# Altium project SpaceSalmon.PrjPcb (part 2 of 2)

## Sheet SAMD51.SchDoc
size A4
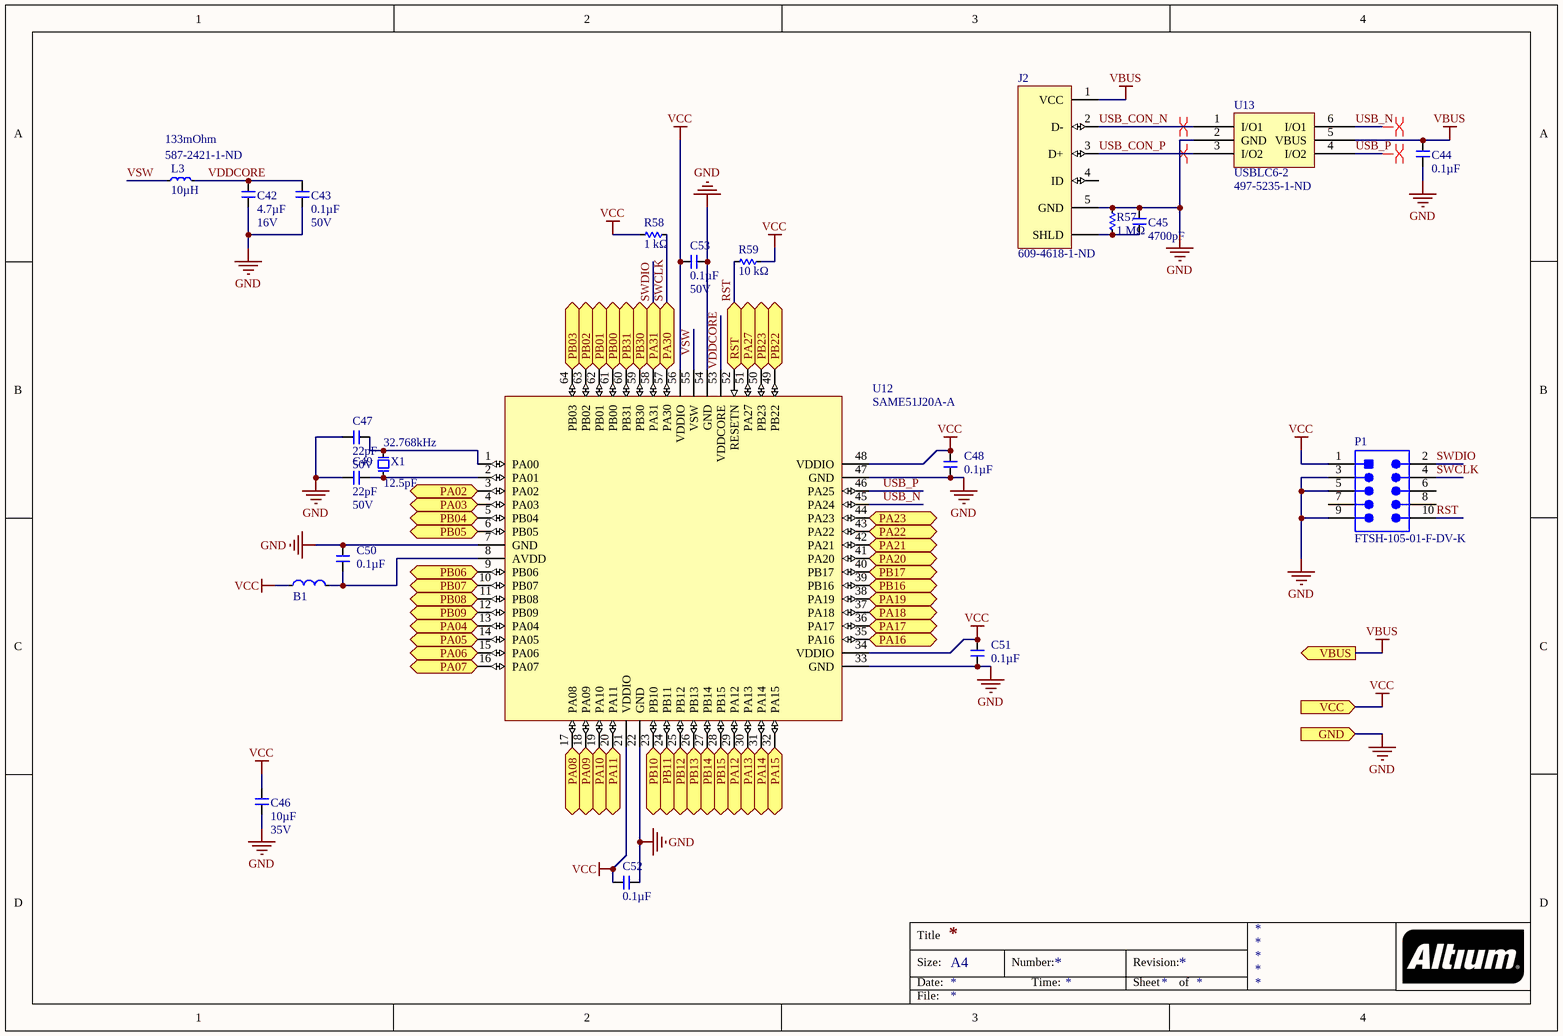
[diagram p5: SAMD51.SchDoc]

### Parts
B1  FB_1608  [R0603]  (value not drawn)
C42  Capacitance (shorthand): 4.7µF  Rated Voltage: 16V  [C0603]  (hidden comment: __template_cap)
C43  Capacitance (shorthand): 0.1µF  Rated Voltage: 50V  [C0603]  (hidden comment: __template_cap)
C44  Capacitance (shorthand): 0.1µF  [C0603]  (hidden comment: __template_cap)
C45  Capacitance (shorthand): 4700pF  [C0603]  (hidden comment: __template_cap)
C46  Capacitance (shorthand): 10µF  Rated Voltage: 35V  [C0603]  (hidden comment: __template_cap)
C47  Capacitance (shorthand): 22pF  Rated Voltage: 50V  [C0603]  (hidden comment: __template_cap)
C48  Capacitance (shorthand): 0.1µF  [C0603]  (hidden comment: __template_cap)
C49  Capacitance (shorthand): 22pF  Rated Voltage: 50V  [C0603]  (hidden comment: __template_cap)
C50  Capacitance (shorthand): 0.1µF  [C0603]  (hidden comment: __template_cap)
C51  Capacitance (shorthand): 0.1µF  [C0603]  (hidden comment: __template_cap)
C52  Capacitance (shorthand): 0.1µF  [C0603]  (hidden comment: __template_cap)
C53  Capacitance (shorthand): 0.1µF  Rated Voltage: 50V  [C0603]  (hidden comment: __template_cap)
J2  Supplier Part Number 1: 609-4618-1-ND  [CONN_USBMICROB_10118194-0001LF]  (hidden comment: CONN_USB_MICROB_SMD_TH_R/A)
L3  DC Resistance (DCR): 133mOhm  Inductance: 10µH  Supplier Part Number 1: 587-2421-1-ND  [C1210]  (hidden comment: INDUCTOR 100UH 270MA 1210 SMD)
P1  FTSH-105-01-F-DV-K  [SMTC-FTSH-105-01-L-DV-K_V]
R57  Resistance: 1 MΩ  [R0603]  (hidden comment: __template_resistor)
R58  Resistance: 1 kΩ  [R0603]  (hidden comment: __template_resistor)
R59  Resistance: 10 kΩ  [R0603]  (hidden comment: __template_resistor)
U12  SAME51J20A-A  [SAMD TQFP-64]
U13  USBLC6-2  Supplier Part Number 1: 497-5235-1-ND  [6SOT23]
X1  Frequency: 32.768kHz  Load Capacitance: 12.5pF  [XTAL_TXC_9HT10]  (hidden comment: XTAL_9HT10-32.768KEZF-T)

### Ports
GND (in), PA02 (bidir), PA03 (bidir), PA04 (bidir), PA05 (bidir), PA06 (bidir), PA07 (bidir), PA08 (bidir), PA09 (bidir), PA10 (bidir), PA11 (bidir), PA12 (bidir), PA13 (bidir), PA14 (bidir), PA15 (bidir), PA16 (bidir), PA17 (bidir), PA18 (bidir), PA19 (bidir), PA20 (bidir), PA21 (bidir), PA22 (bidir), PA23 (bidir), PA27 (bidir), PA30 (bidir), PA31 (bidir), PB00 (bidir), PB01 (bidir), PB02 (bidir), PB03 (bidir), PB04 (bidir), PB05 (bidir), PB06 (bidir), PB07 (bidir), PB08 (bidir), PB09 (bidir), PB10 (bidir), PB11 (bidir), PB12 (bidir), PB13 (bidir), PB14 (bidir), PB15 (bidir), PB16 (bidir), PB17 (bidir), PB22 (bidir), PB23 (bidir), PB30 (bidir), PB31 (bidir), RST (bidir), VBUS (out), VCC (in)

### Nets
GND: C42.1 C43.2 C44.2 C45.1 C46.1 C47.1 C48.1 C49.1 C50.1 C51.1 C52.2 C53.1 J2.5(GND) P1.3 P1.5 P1.9 R57.2 U12.7(GND) U12.22(GND) U12.33(GND) U12.47(GND) U12.54(GND) U13.2(GND) ; port GND  [project net SELF_GND]
VBACKUP: U12.64(PB03) ; port PB03
VBUS: C44.1 J2.1(VCC) U13.5(VBUS) ; port VBUS
VCC: B1.1 C46.2 C48.2 C51.2 C52.1 C53.2 P1.1 R58.2 R59.2 U12.21(VDDIO) U12.34(VDDIO) U12.48(VDDIO) U12.56(VDDIO) ; port VCC  [project net 3V3]
ACCEL_CS_1: U12.12(PB09) ; port PB09
ACCEL_CS_2: U12.6(PB05) ; port PB05
ACCEL_INT_1: U12.50(PB23) ; port PB23
ACCEL_INT_2: U12.39(PB16) ; port PB16
ADXL_CS_1: U12.9(PB06) ; port PB06
ADXL_CS_2: U12.3(PA02) ; port PA02
ADXL_INT_1: U12.49(PB22) ; port PB22
ADXL_INT_2: U12.31(PA14) ; port PA14
BAT_SNS_A: U12.63(PB02) ; port PB02
BAT_SNS_B: U12.62(PB01) ; port PB01
BMP_CS_1: U12.10(PB07) ; port PB07
BMP_CS_2: U12.4(PA03) ; port PA03
BUZZER: U12.61(PB00) ; port PB00
CAN_STBY_1: U12.41(PA20) ; port PA20
CAN_STBY_2: U12.42(PA21) ; port PA21
GYRO_CS_1: U12.11(PB08) ; port PB08
GYRO_CS_2: U12.5(PB04) ; port PB04
GYRO_INT_1: U12.51(PA27) ; port PA27
GYRO_INT_2: U12.40(PB17) ; port PB17
LED_3: U12.59(PB30) ; port PB30
LED_4: U12.60(PB31) ; port PB31
MISO: U12.13(PA04) ; port PA04
MOSI: U12.16(PA07) ; port PA07
RST: P1.10 R59.1 U12.52(RESETN) ; port RST
SCK: U12.14(PA05) ; port PA05
SD_CD: U12.15(PA06) ; port PA06
SD_CLK: U12.24(PB11) ; port PB11
SD_CMD: U12.17(PA08) ; port PA08
SD_DAT0: U12.18(PA09) ; port PA09
SD_DAT1: U12.19(PA10) ; port PA10
SD_DAT2: U12.20(PA11) ; port PA11
SD_DAT3: U12.23(PB10) ; port PB10
SWCLK: P1.4 R58.1 U12.57(PA30) ; port PA30  [project net LED_1]
SWDIO: P1.2 U12.58(PA31) ; port PA31  [project net LED_2]
USB_CON_N: J2.2(D-) U13.1(I/O1)
USB_CON_P: J2.3(D+) U13.3(I/O2)
USB_N: U12.45(PA24) U13.6(I/O1)
USB_P: U12.46(PA25) U13.4(I/O2)
VDDCORE: C42.2 C43.1 L3.1 U12.53(VDDCORE)
VSW: L3.2 U12.55(VSW)
NetB1_2: B1.2 C50.2 U12.8(AVDD)
NetC45_2: C45.2 J2.SHIELD(SHLD) R57.1
NetC47_2: C47.2 U12.1(PA00) X1.2
NetC49_2: C49.2 U12.2(PA01) X1.1
NetCANA1_1: U12.26(PB13) ; port PB13
NetCANA1_4: U12.25(PB12) ; port PB12
NetCANB1_1: U12.44(PA23) ; port PA23
NetCANB1_4: U12.43(PA22) ; port PA22
NetJ1_1: U12.30(PA13) ; port PA13
NetJ1_2: U12.29(PA12) ; port PA12
NetU12_27: U12.27(PB14) ; port PB14
NetU12_28: U12.28(PB15) ; port PB15
NetU12_32: U12.32(PA15) ; port PA15
NetU12_35: U12.35(PA16) ; port PA16
NetU12_36: U12.36(PA17) ; port PA17
NetU12_37: U12.37(PA18) ; port PA18
NetU12_38: U12.38(PA19) ; port PA19

Not connected (* = marked no-connect by the designer): J2 4(ID); P1 6 7 8

### Layout directives
differential pair: USB_CON_N, USB_CON_P, USB_N, USB_P

### Notes on the sheet
- Title
- Size:
- Date:
- A4
- Number:
- Time:
- Revision:
- Sheet
- of
- File:

### Library data of the parts
B1 = FB_1608: FERRITE BEAD 600 OHM 300mA; Manufacturer: Taiyo Yuden; Manufacturer Part Number: BK1608HW601-T; Number of Lines: 1; Impedance @ Frequency: 600 Ohm @ 100MHz; DC Resistance (DCR) (Max): 400 mOhm; Supplier 1: Digi-Key; Supplier Part Number 1: 587-1879-1-ND; RoHS: RoHS Compliant; Category: Filters; Stock 1: 11908; Pricing 1: 1=0.1, 10=0.059, 50=0.0474, 100=0.0426, 250=0.0312, 500=0.0227, 1000=0.02223 (USD); Packaging: Cut Tape (CT); Part Status: Active; Filter Type: -; Current Rating (Max): 300mA; Ratings: -; Operating Temperature: -55°C ~ 125°C; Package / Case: 0603 (1608 Metric); Mounting Type: Surface Mount; Height (Max): 0.037" (0.95mm); Size / Dimension: 0.063" L x 0.031" W (1.60mm x 0.80mm); ComponentLink1URL: http://ds.yuden.co.jp/TYCOMPAS/ut/detail.do?productNo=BK1608HW601-T&fileName=BK1608HW601-T_SS&mode=specSheetDownload; ComponentLink1Description: http://ds.yuden.co.jp/TYCOMPAS/ut/detail.do?productNo=BK1608HW601-T&fileName=BK1608HW601-T_SS&mode=specSheetDownload
C42 = CAP CER 4.7UF 16V X5R 0603 10%: Manufacturer: Yageo; Capacitance - pF (Machine readable): 4700000; type: capacitor; Dielectric: X5R; Supplier 1: Digikey; Supplier Part Number 1: 311-1785-1-ND
C43 C44 C48 C50-C53 = CAP CER 0603 0.1µF X7R 50V 10%: Manufacturer: Murata Electronics North America; Capacitance - pF (Machine readable): 100000; type: capacitor; Dielectric: X7R; Supplier 1: Digikey; Supplier Part Number 1: 490-1519-1-ND
C45 = CAP CER 0603 4700pF X7R 50V 10%: Manufacturer: Murata Electronics North America; Capacitance - pF (Machine readable): 4700; type: capacitor; Dielectric: X7R; Supplier 1: Digikey; Supplier Part Number 1: 490-1506-1-ND
C46 = CAP CER 10UF 35V X5R 0603 20%: Manufacturer: Murata Electronics North America; Capacitance - pF (Machine readable): 10000000; type: capacitor; Dielectric: X5R; Supplier 1: Digikey; Supplier Part Number 1: 490-13248-1-ND
C47 C49 = CAP CER 22PF 50V C0G/NP0 0603: Manufacturer: Murata Electronics North America; Capacitance - pF (Machine readable): 22; type: capacitor; Dielectric: C0G, NP0; Description: CAP CER 22PF 50V C0G/NP0 0603; Supplier 1: Digikey; Supplier Part Number 1: 490-1411-1-ND
J2 = CONN_USB_MICROB_SMD_TH_R/A: Through Hole Micro USB Connector; Manufacturer: Amphenol FCI; Manufacturer Part Number: 10118194-0001LF; Gender: Receptacle; Current Rating: 1.8A; Connector Type: USB,Receptacle; Number of Contacts: 5; Insulation Resistance: 1GR; Number of Ports: 1; Max Voltage Rating (AC): 100V; Pitch: 0.65mm; Supplier 1: Digi-Key; Stock 1: 180464; Pricing 1: 1=0.46, 10=0.437, 25=0.3744, 50=0.318, 100=0.3056, 250=0.2744, 500=0.262 (USD); Mount: Surface Mount,Horizontal; Contact Material: Copper Alloy; Contact Plating: Nickel,Gold; Number of Terminals: 5; Housing Material: Polymer; Colour: Black; Min Operating Temperature: -55°C; Max Operating Temperature: 85°C; Package Quantity: 9600; Packaging: Tape and Reel; Termination: Solder; Orientation: Right Angle; Length: 8.05mm; Depth: 5mm; Radiation Hardening: No; Lead Free: Lead Free; Flammability Rating: UL94 V-0; ComponentLink1URL: https://datasheet.ciiva.com/851/10118194-851110.pdf; ComponentLink1Description: https://datasheet.ciiva.com/851/10118194-851110.pdf; ComponentLink2URL: https://datasheet.ciiva.com/851/10118194-851111.pdf; ComponentLink2Description: https://datasheet.ciiva.com/851/10118194-851111.pdf; ComponentLink3URL: https://datasheet.ciiva.com/4598/10118194ac-197217-4598807.pdf; ComponentLink3Description: https://datasheet.ciiva.com/4598/10118194ac-197217-4598807.pdf; ComponentLink4URL: https://datasheet.ciiva.com/29907/10118194-29907230.pdf; ComponentLink4Description: https://datasheet.ciiva.com/29907/10118194-29907230.pdf; ComponentLink5URL: https://datasheet.ciiva.com/26945/getdatasheetpartid-418619-26945695.pdf; ComponentLink5Description: https://datasheet.ciiva.com/26945/getdatasheetpartid-418619-26945695.pdf
L3 = IND_BRL3225T101K: Manufacturer: Taiyo Yuden; Current - Temperature Rise: 250mA; Tolerance: ±10%; Shielding: Unshielded; Frequency - Self Resonant: 5MHz; Frequency - Test: 100kHz; Manufacturer Part Number: BRL3225T101K; RoHS: RoHS Compliant; Category: Inductors, Coils, Chokes; Current - Saturation: 270mA; Type: -; Q @ Freq: -; Applications: Power Supplies; Material - Core: -; Package / Case: 1210 (3225 Metric); Mounting Type: Surface Mount; Packaging: Cut Tape (CT); Operating Temperature: -40°C ~ 105°C; ComponentLink1URL: http://www.yuden.co.jp/ut/product/pdf/wound07_e.pdf; ComponentLink1Description: Datasheet; Current: 270mA; Supplier 1: Digi-Key
P1 = CMP-2000-05352-1: Male Header, Pitch 1.27 mm, 2 x 5 Position, Height 6.12 mm, RoHS, Tube; Manufacturer: Samtec; Number of Positions: 10; Connector Type: Header,Shrouded; Number of Positions Loaded: All; Fastening Type: -; Package Reference: FTSH-105-01-L-DV-K; Termination: Solder; Package URL: http://suddendocs.samtec.com/prints/ftsh-1xx-xx-xxx-dv-xxx-footprint.pdf; Number of Rows: 2; Contact Finish Thickness: 3µin(0.08µm); Contact Type: MalePin; Manufacturer URL: http://www.samtec.com/; Series: FTSH; Features: -; Contact Finish: Gold; Color: Black; Family: RectangularConnectors-Headers,MalePins; Datasheet URL: http://suddendocs.samtec.com/prints/ftsh-1xx-xx-xxx-dv-xxx-mkt.pdf; Package Description: Male Header, Pitch 1.27 mm, 2 x 5 Position, Height 5.97 mm, Tail Length 4.32 mm; Mounting Type: SurfaceMount; Datasheet Version: Rev. ET, 10/1995; Category: Connectors,Interconnects; Packaging: Tube
R57 = RES SMD 1M OHM 1% 1/10W 0603: Manufacturer Part Number: RC0603FR-071ML; Manufacturer: Yageo; Resistance (Sortable): 1000000; Tolerance: ±1%; Power (Watts): 0.1W, 1/10W; Temperature Coefficient: ±100ppm/°C; Supplier 1: Digikey; Datasheets: http://www.yageo.com/documents/recent/PYu-RC_Group_51_RoHS_L_9.pdf; Image: //media.digikey.com/Renders/Yageo%20Renders/0603-(1608-Metric).jpg; Supplier Part Number 1: 311-1.00MHRCT-ND; Operating Temperature: -55°C ~ 155°C
R58 = RES SMD 1K OHM 1% 1/10W 0603: Manufacturer Part Number: RC0603FR-071KL; Manufacturer: Yageo; Resistance (Sortable): 1000; Tolerance: ±1%; Power (Watts): 0.1W, 1/10W; Temperature Coefficient: ±100ppm/°C; Supplier 1: Digikey; Datasheets: http://www.yageo.com/documents/recent/PYu-RC_Group_51_RoHS_L_9.pdf; Image: //media.digikey.com/Renders/Yageo%20Renders/0603-(1608-Metric).jpg; Supplier Part Number 1: 311-1.00KHRCT-ND; Operating Temperature: -55°C ~ 155°C
R59 = RES SMD 10K OHM 1% 1/10W 0603: Manufacturer Part Number: RC0603FR-0710KL; Manufacturer: Yageo; Resistance (Sortable): 10000; Tolerance: ±1%; Power (Watts): 0.1W, 1/10W; Temperature Coefficient: ±100ppm/°C; Supplier 1: Digikey; Datasheets: http://www.yageo.com/documents/recent/PYu-RC_Group_51_RoHS_L_9.pdf; Image: //media.digikey.com/Renders/Yageo%20Renders/0603-(1608-Metric).jpg; Supplier Part Number 1: 311-10.0KHRCT-ND; Operating Temperature: -55°C ~ 155°C
U12 = SAME51J20A-A: Atmel SAM ARM Cortex M4; ComponentLink1Description: Product Page; ComponentLink1URL: https://www.microchip.com/wwwproducts/en/ATSAMD21G18; ComponentLink2Description: Datasheet; ComponentLink2URL: http://ww1.microchip.com/downloads/en/DeviceDoc/SAM-D21-Family-Datasheet-DS40001882C.pdf
U13 = USBLC6-2: Manufacturer: STMicroelectronics; Manufacturer Part Number: USBLC6-2SC6; Unidirectional Channels: 2; Voltage - Reverse Standoff (Typ): 5.25V; Voltage - Breakdown (Min): 6V; Voltage - Clamping (Max) @ Ipp: 17V; Current - Peak Pulse (10/1000µs): 5A (8/20µs); Power Line Protection: Yes; Supplier 1: Digi-Key; RoHS: RoHS Compliant; Category: Circuit Protection; Stock 1: 31719; Pricing 1: 1=0.51, 10=0.411, 100=0.2802, 500=0.21012, 1000=0.15759 (USD); Packaging: Cut Tape (CT); Part Status: Active; Type: Steering (Rail to Rail); Bidirectional Channels: -; Power - Peak Pulse: -; Applications: Ethernet; Capacitance @ Frequency: -; Operating Temperature: -40°C ~ 125°C (TJ); Mounting Type: Surface Mount; Package / Case: SOT-23-6; Supplier Device Package: SOT-23-6; ComponentLink1URL: http://www.st.com/web/en/resource/technical/document/datasheet/CD00050750.pdf; ComponentLink1Description: http://www.st.com/web/en/resource/technical/document/datasheet/CD00050750.pdf
X1 = XTAL_9HT10-32.768KEZF-T: CRYSTAL 32.768 KHZ 12.5 PF SMD; Manufacturer: TXC CORPORATION; Frequency Tolerance: ±10ppm; ESR (Equivalent Series Resistance): 70 kOhm; Operating Mode: Fundamental; Supplier 1: Digi-Key; Manufacturer Part Number: 9HT10-32.768KEZF-T; RoHS: RoHS Compliant; Category: Crystals and Oscillators; Stock 1: 5250; Pricing 1: 1=1.88, 10=1.625, 50=1.425, 100=1.125, 500=0.95, 1000=0.75 (USD); Type: kHz Crystal (Tuning Fork); Frequency Stability: -; Operating Temperature: -40°C ~ 85°C; Ratings: -; Mounting Type: Surface Mount; Package / Case: 2-SMD; Size / Dimension: 0.126" L x 0.059" W (3.20mm x 1.50mm); Height: 0.033" (0.85mm); Packaging: Cut Tape (CT); ComponentLink1URL: http://www.txccrystal.com/images/pdf/9ht10.pdf; ComponentLink1Description: Datasheet; Supplier Part Number 1: 887-1507-1-ND

## Sheet Stack_B.SchDoc
size A4
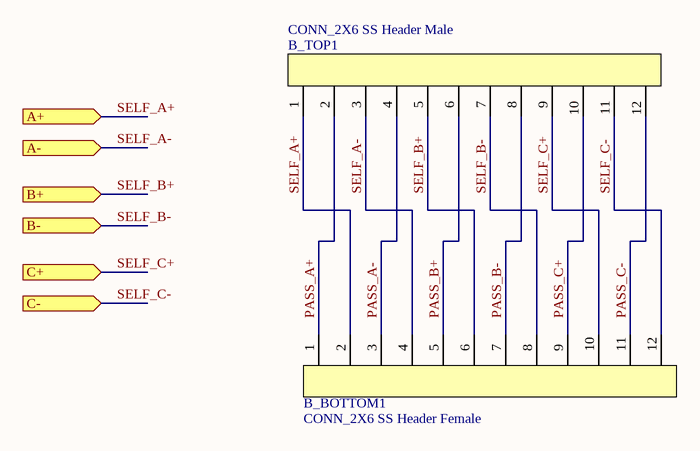
[diagram p6: Stack_B.SchDoc]

### Parts
B_BOTTOM1  CONN_2X6 SS Header Female  [SAMTEC_SSW-106-22-F-D-VS]
B_TOP1  CONN_2X6 SS Header Male  [SAMTEC_TSM-106-03-F-DV]

### Ports
A+ (in), A- (in), B+ (in), B- (in), C+ (in), C- (in)

### Nets
PASS_A+: B_BOTTOM1.1 B_TOP1.2
PASS_A-: B_BOTTOM1.3 B_TOP1.4
PASS_B+: B_BOTTOM1.5 B_TOP1.6
PASS_B-: B_BOTTOM1.7 B_TOP1.8
PASS_C+: B_BOTTOM1.9 B_TOP1.10
PASS_C-: B_BOTTOM1.11 B_TOP1.12
SELF_A+: B_BOTTOM1.2 B_TOP1.1 ; port A+
SELF_A-: B_BOTTOM1.4 B_TOP1.3 ; port A-
SELF_B+: B_BOTTOM1.6 B_TOP1.5 ; port B+
SELF_B-: B_BOTTOM1.8 B_TOP1.7 ; port B-
SELF_C+: B_BOTTOM1.10 B_TOP1.9 ; port C+
SELF_C-: B_BOTTOM1.12 B_TOP1.11 ; port C-

### Notes on the sheet
- Title
- Size:
- Date:
- A4
- Number:
- Time:
- Revision:
- Sheet
- of
- File:

### Library data of the parts
B_BOTTOM1 B_TOP1 = CONN_2X6 SS Header

## Sheet Stack_A.SchDoc
size A3 portrait
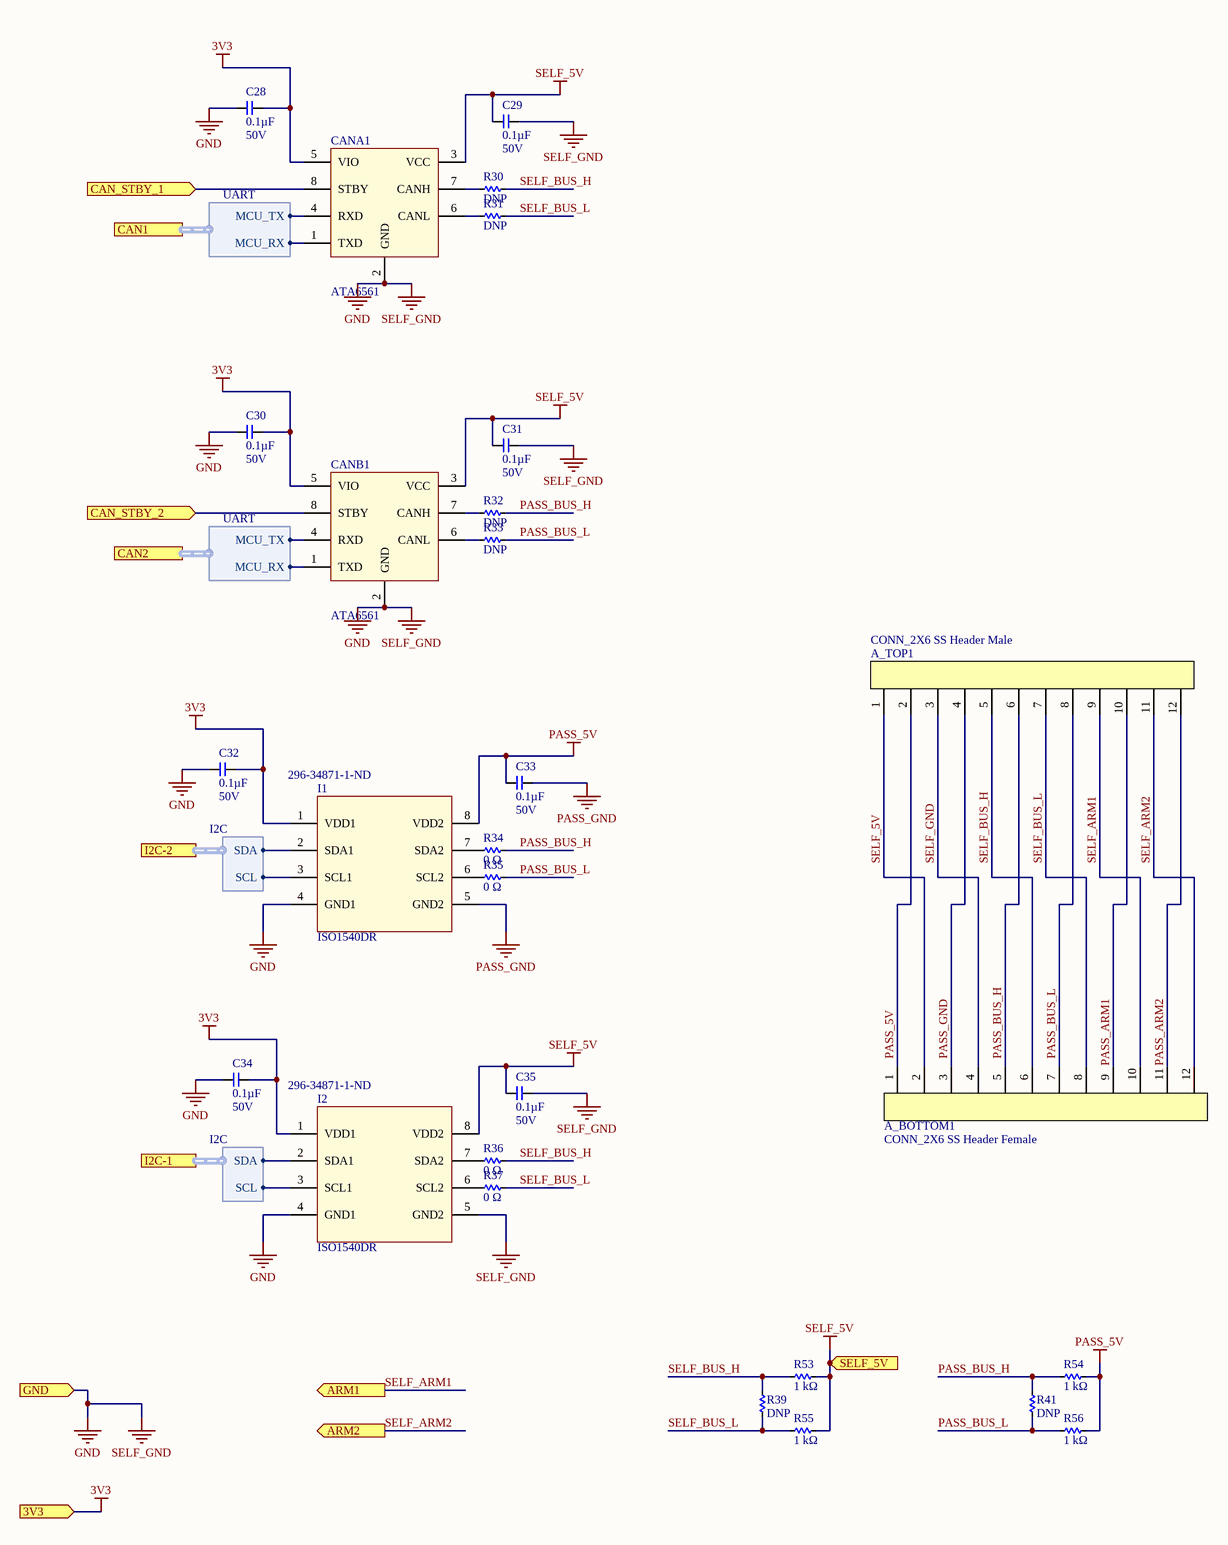
[diagram p7: Stack_A.SchDoc]

### Parts
A_BOTTOM1  CONN_2X6 SS Header Female  [SAMTEC_SSW-106-22-F-D-VS]
A_TOP1  CONN_2X6 SS Header Male  [SAMTEC_TSM-106-03-F-DV]
C28  Capacitance (shorthand): 0.1µF  Rated Voltage: 50V  [C0603]  (hidden comment: __template_cap)
C29  Capacitance (shorthand): 0.1µF  Rated Voltage: 50V  [C0603]  (hidden comment: __template_cap)
C30  Capacitance (shorthand): 0.1µF  Rated Voltage: 50V  [C0603]  (hidden comment: __template_cap)
C31  Capacitance (shorthand): 0.1µF  Rated Voltage: 50V  [C0603]  (hidden comment: __template_cap)
C32  Capacitance (shorthand): 0.1µF  Rated Voltage: 50V  [C0603]  (hidden comment: __template_cap)
C33  Capacitance (shorthand): 0.1µF  Rated Voltage: 50V  [C0603]  (hidden comment: __template_cap)
C34  Capacitance (shorthand): 0.1µF  Rated Voltage: 50V  [C0603]  (hidden comment: __template_cap)
C35  Capacitance (shorthand): 0.1µF  Rated Voltage: 50V  [C0603]  (hidden comment: __template_cap)
CANA1  ATA6561  [8SOIC150]
CANB1  ATA6561  [8SOIC150]
I1  Manufacturer Part Number: ISO1540DR  Supplier Part Number 1: 296-34871-1-ND  [8SOIC150]  (hidden comment: ISO_Si8401AB-B-IS)
I2  Manufacturer Part Number: ISO1540DR  Supplier Part Number 1: 296-34871-1-ND  [8SOIC150]  (hidden comment: ISO_Si8401AB-B-IS)
R30  Resistance: DNP  [R0603]  (hidden comment: __template_resistor)
R31  Resistance: DNP  [R0603]  (hidden comment: __template_resistor)
R32  Resistance: DNP  [R0603]  (hidden comment: __template_resistor)
R33  Resistance: DNP  [R0603]  (hidden comment: __template_resistor)
R34  Resistance: 0 Ω  [R0603]  (hidden comment: __template_resistor)
R35  Resistance: 0 Ω  [R0603]  (hidden comment: __template_resistor)
R36  Resistance: 0 Ω  [R0603]  (hidden comment: __template_resistor)
R37  Resistance: 0 Ω  [R0603]  (hidden comment: __template_resistor)
R39  Resistance: DNP  [R0603]  (hidden comment: __template_resistor)
R41  Resistance: DNP  [R0603]  (hidden comment: __template_resistor)
R53  Resistance: 1 kΩ  [R0603]  (hidden comment: __template_resistor)
R54  Resistance: 1 kΩ  [R0603]  (hidden comment: __template_resistor)
R55  Resistance: 1 kΩ  [R0603]  (hidden comment: __template_resistor)
R56  Resistance: 1 kΩ  [R0603]  (hidden comment: __template_resistor)

### Ports
3V3 (in), ARM1 (out), ARM2 (out), CAN1 (harness UART), CAN2 (harness UART), CAN_STBY_1 (in), CAN_STBY_2 (in), GND (in), I2C-1 (harness I2C), I2C-2 (harness I2C), SELF_5V (in)

### Harnesses
UART: MCU_RX, MCU_TX
I2C: SDA, SCL

### Nets
3V3: C28.2 C30.2 C32.2 C34.2 CANA1.5(VIO) CANB1.5(VIO) I1.1(VDD1) I2.1(VDD1) ; port 3V3
PASS_5V: A_BOTTOM1.1 A_TOP1.2 C33.2 I1.8(VDD2) R54.2 R56.2
PASS_GND: A_BOTTOM1.3 A_TOP1.4 C33.1 I1.5(GND2)
SELF_5V: A_BOTTOM1.2 A_TOP1.1 C29.2 C31.2 C35.2 CANA1.3(VCC) CANB1.3(VCC) I2.8(VDD2) R53.2 R55.2 ; port SELF_5V  [project net 5V0]
SELF_GND: A_BOTTOM1.4 A_TOP1.3 C28.1 C29.1 C30.1 C31.1 C32.1 C34.1 C35.1 CANA1.2(GND) CANB1.2(GND) I1.4(GND1) I2.4(GND1) I2.5(GND2) ; port GND  [also labelled GND]
CAN_STBY_1: CANA1.8(STBY) ; port CAN_STBY_1
CAN_STBY_2: CANB1.8(STBY) ; port CAN_STBY_2
PASS_ARM1: A_BOTTOM1.9 A_TOP1.10
PASS_ARM2: A_BOTTOM1.11 A_TOP1.12
PASS_BUS_H: A_BOTTOM1.5 A_TOP1.6 R32.2 R34.2 R41.2 R54.1
PASS_BUS_L: A_BOTTOM1.7 A_TOP1.8 R33.2 R35.2 R41.1 R56.1
SELF_ARM1: A_BOTTOM1.10 A_TOP1.9 ; port ARM1
SELF_ARM2: A_BOTTOM1.12 A_TOP1.11 ; port ARM2
SELF_BUS_H: A_BOTTOM1.6 A_TOP1.5 R30.2 R36.2 R39.2 R53.1
SELF_BUS_L: A_BOTTOM1.8 A_TOP1.7 R31.2 R37.2 R39.1 R55.1
NetCANA1_1: CANA1.1(TXD) I2.3(SCL1) ; port CAN1.MCU_RX, port I2C-1.SCL
NetCANA1_4: CANA1.4(RXD) I2.2(SDA1) ; port CAN1.MCU_TX, port I2C-1.SDA
NetCANA1_6: CANA1.6(CANL) R31.1
NetCANA1_7: CANA1.7(CANH) R30.1
NetCANB1_1: CANB1.1(TXD) I1.2(SDA1) ; port I2C-2.SDA, port CAN2.MCU_RX
NetCANB1_4: CANB1.4(RXD) I1.3(SCL1) ; port I2C-2.SCL, port CAN2.MCU_TX
NetCANB1_6: CANB1.6(CANL) R33.1
NetCANB1_7: CANB1.7(CANH) R32.1
NetI1_6: I1.6(SCL2) R35.1
NetI1_7: I1.7(SDA2) R34.1
NetI2_6: I2.6(SCL2) R37.1
NetI2_7: I2.7(SDA2) R36.1

### Notes on the sheet
- Title
- Size:
- Date:
- A3
- Number:
- Time:
- Revision:
- Sheet
- of
- File:

### Library data of the parts
A_BOTTOM1 A_TOP1 = CONN_2X6 SS Header
C28-C35 = CAP CER 0603 0.1µF X7R 50V 10%: as C43 on sheet SAMD51; Supplier 1: Digikey; Supplier Part Number 1: 490-1519-1-ND
CANA1 CANB1 = ATA6561: Atmel CAN Bus Transciever; Supplier 1: Digi-Key; Supplier Part Number 1: ATA6561-GAQW-NCT-ND
I1 I2 = ISO_Si8401AB-B-IS: Isolator Interface IC 2.5 kV Bidirectional I2C Isolator 1.7MHz; Manufacturer: Texas Instruments; Supply Current: 3.9 mA; Number of Channels: 2; Power Dissipation: 220 W; Supply Voltage (Max): 5.5 V; Supply Voltage (Min): 3 V; Propagation Delay Time: 20 ns; Product Status: New Technology; RoHS: RoHS Compliant; Category: Isolator Interface IC; Package / Case: SOIC-8 Narrow; Packaging: Tube; Mounting Style: SMD/SMT; Maximum Operating Temperature: + 125 C; Minimum Operating Temperature: - 40 C; Product Category: Power - Digital Isoloators; RoHS - Mouser: Y; Minimum Order Quantity: 1; Reeling: False; ComponentLink1URL: http://www.silabs.com/Support%20Documents/TechnicalDocs/Si840x.pdf; ComponentLink1Description: Datasheet; Supplier 1: Digi-Key
R30-R33 R39 R41 = RES SMD DNP 0603: Resistance (Sortable): DNP
R34-R37 = RES SMD 0 OHM JUMPER 1/10W 0603: Manufacturer Part Number: RC0603FR-070RL; Manufacturer: Yageo; Resistance (Sortable): 0; Tolerance: Jumper; Power (Watts): 0.1W, 1/10W; Supplier 1: Digikey; Datasheets: http://www.yageo.com/documents/recent/PYu-RC_Group_51_RoHS_L_9.pdf; Image: //media.digikey.com/Renders/Yageo%20Renders/0603-(1608-Metric).jpg; Supplier Part Number 1: 311-0.0HRCT-ND; Temperature Coefficient: -; Operating Temperature: -55°C ~ 155°C
R53-R56 = RES SMD 1K OHM 1% 1/10W 0603: as R58 on sheet SAMD51; Supplier 1: Digikey; Datasheets: http://www.yageo.com/documents/recent/PYu-RC_Group_51_RoHS_L_9.pdf; Image: //media.digikey.com/Renders/Yageo%20Renders/0603-(1608-Metric).jpg; Supplier Part Number 1: 311-1.00KHRCT-ND; Operating Temperature: -55°C ~ 155°C

## Sheet MC33797.SchDoc: Top Sheet
size A4; Project: World Domination Satellite
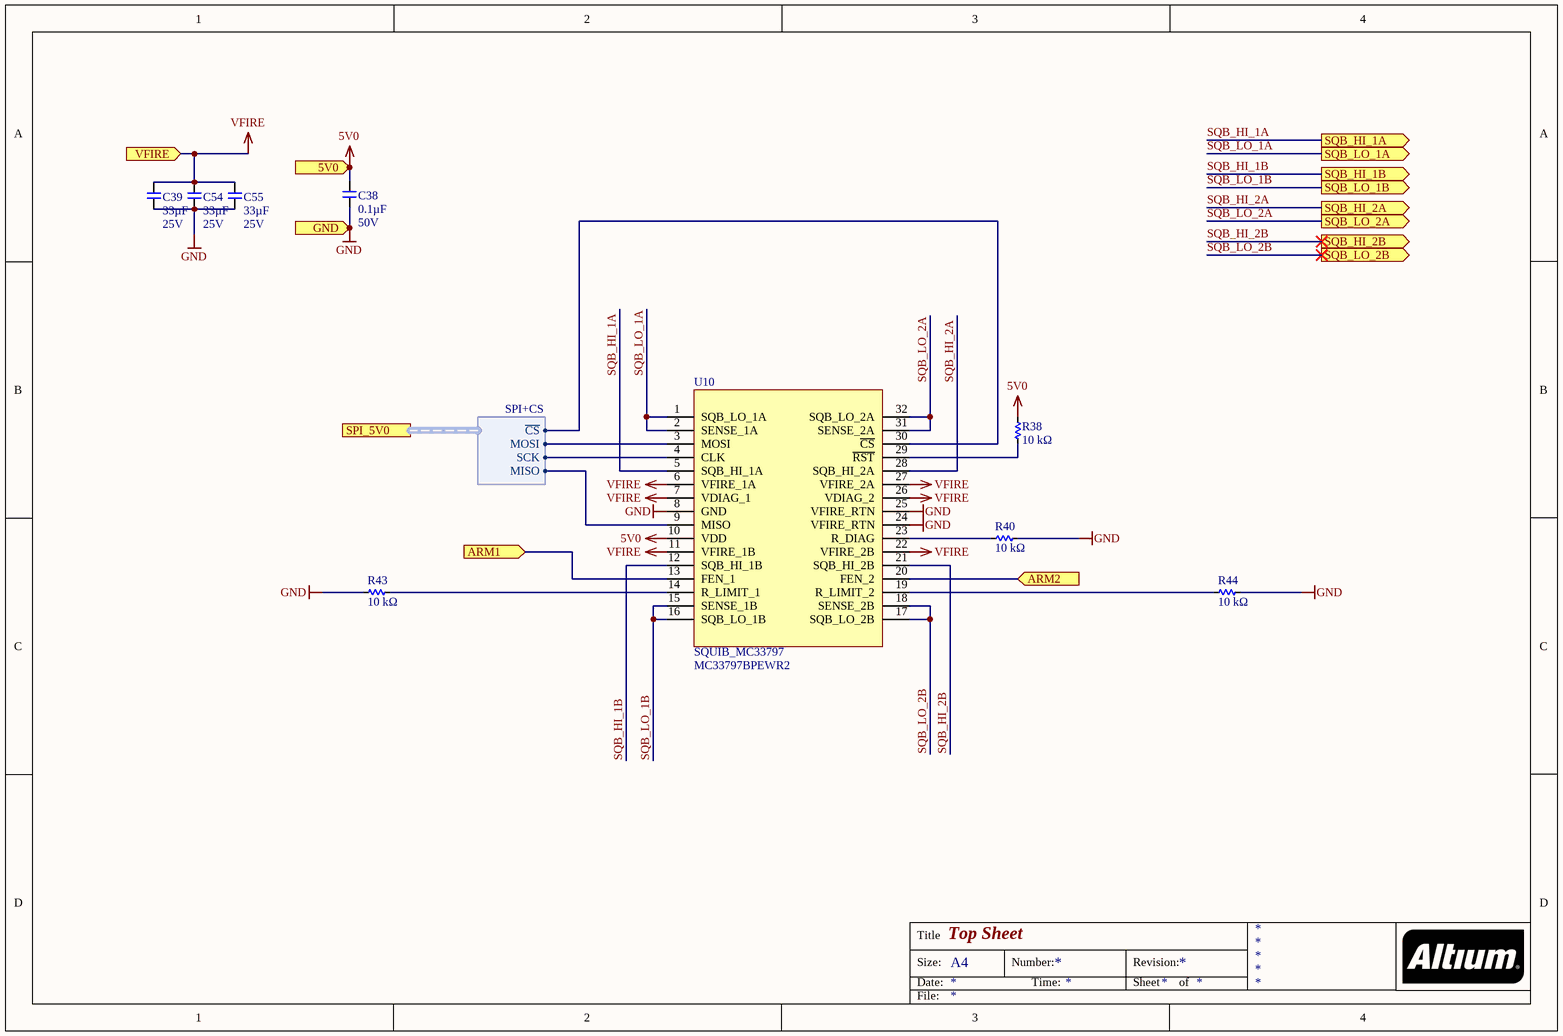
[diagram p8: MC33797.SchDoc]

### Parts
C38  Capacitance (shorthand): 0.1µF  Rated Voltage: 50V  [C0603]  (hidden comment: __template_cap)
C39  Capacitance: 33µF  Voltage - Rated: 25V  [C1206]  (hidden comment: CAP_33UF_1206_SMD)
C54  Capacitance: 33µF  Voltage - Rated: 25V  [C1206]  (hidden comment: CAP_33UF_1206_SMD)
C55  Capacitance: 33µF  Voltage - Rated: 25V  [C1206]  (hidden comment: CAP_33UF_1206_SMD)
R38  Resistance: 10 kΩ  [R0603]  (hidden comment: __template_resistor)
R40  Resistance: 10 kΩ  [R0603]  (hidden comment: __template_resistor)
R43  Resistance: 10 kΩ  [R0603]  (hidden comment: __template_resistor)
R44  Resistance: 10 kΩ  [R0603]  (hidden comment: __template_resistor)
U10  SQUIB_MC33797  Manufacturer Part Number: MC33797BPEWR2  [SOT1762-1]

### Ports
5V0 (in), ARM1 (in), ARM2 (in), GND (in), SPI_5V0 (harness SPI+CS), SQB_HI_1A (out), SQB_HI_1B (out), SQB_HI_2A (out), SQB_HI_2B (out), SQB_LO_1A (out), SQB_LO_1B (out), SQB_LO_2A (out), SQB_LO_2B (out), VFIRE (in)

### Harnesses
SPI+CS: ~{CS}, SCK, MOSI, MISO

### Nets
5V0: C38.1 R38.2 U10.10(VDD) ; port 5V0
GND: C38.2 C39.2 C54.2 C55.2 R40.2 R43.1 R44.2 U10.8(GND) U10.24(VFIRE_RTN) U10.25(VFIRE_RTN) ; port GND  [project net SELF_GND]
VFIRE: C39.1 C54.1 C55.1 U10.6(VFIRE_1A) U10.7(VDIAG_1) U10.11(VFIRE_1B) U10.22(VFIRE_2B) U10.26(VDIAG_2) U10.27(VFIRE_2A) ; port VFIRE  [project net VBAT]
ARM1: U10.13(FEN_1) ; port ARM1
ARM2: U10.20(FEN_2) ; port ARM2
SQB_HI_1A: U10.5(SQB_HI_1A) ; port SQB_HI_1A  [project net SELF_A+]
SQB_HI_1B: U10.12(SQB_HI_1B) ; port SQB_HI_1B  [project net SELF_B+]
SQB_HI_2A: U10.28(SQB_HI_2A) ; port SQB_HI_2A  [project net SELF_C+]
SQB_HI_2B: U10.21(SQB_HI_2B) ; port SQB_HI_2B
SQB_LO_1A: U10.1(SQB_LO_1A) U10.2(SENSE_1A) ; port SQB_LO_1A  [project net SELF_A-]
SQB_LO_1B: U10.15(SENSE_1B) U10.16(SQB_LO_1B) ; port SQB_LO_1B  [project net SELF_B-]
SQB_LO_2A: U10.31(SENSE_2A) U10.32(SQB_LO_2A) ; port SQB_LO_2A  [project net SELF_C-]
SQB_LO_2B: U10.17(SQB_LO_2B) U10.18(SENSE_2B) ; port SQB_LO_2B
NetR38_1: R38.1 U10.29(~{RST})
NetR40_1: R40.1 U10.23(R_DIAG)
NetR43_2: R43.2 U10.14(R_LIMIT_1)
NetR44_1: R44.1 U10.19(R_LIMIT_2)
NetU10_3: U10.3(MOSI) ; port SPI_5V0.MOSI
NetU10_4: U10.4(CLK) ; port SPI_5V0.SCK
NetU10_9: U10.9(MISO) ; port SPI_5V0.MISO
NetU10_30: U10.30(~{CS}) ; port SPI_5V0.~{CS}

### Notes on the sheet
- Title
- Size:
- Date:
- A4
- Number:
- Time:
- Revision:
- Sheet
- of
- File:

### Library data of the parts
C38 = CAP CER 0603 0.1µF X7R 50V 10%: as C43 on sheet SAMD51; Supplier Part Number 1: 490-1519-1-ND; Supplier 1: Digikey
C39 C54 C55 = CAP_100UF_1206_SMD: 100UF SMD CAP CERAMIC; Manufacturer: Murata Electronics North America; Manufacturer Part Number: GRM31CD80J107ME39L; Tolerance: ±20%; Temperature Coefficient: X6T; RoHS: RoHS Compliant; Category: Capacitors; Packaging: Cut Tape (CT); Part Status: Active; Operating Temperature: -55°C ~ 105°C; Features: Derating Recommended; Ratings: -; Applications: General Purpose; Mounting Type: Surface Mount, MLCC; Package / Case: 1206 (3216 Metric); Size / Dimension: 0.126" L x 0.063" W (3.20mm x 1.60mm); Height - Seated (Max): -; Thickness (Max): 0.071" (1.80mm); Lead Spacing: -; Lead Style: -; Supplier 1: Digi-Key; Supplier Part Number 1: 445-8046-1-ND
R38 R40 R43 R44 = RES SMD 10K OHM 1% 1/10W 0603: as R59 on sheet SAMD51; Supplier 1: Digikey; Datasheets: http://www.yageo.com/documents/recent/PYu-RC_Group_51_RoHS_L_9.pdf; Image: //media.digikey.com/Renders/Yageo%20Renders/0603-(1608-Metric).jpg; Supplier Part Number 1: 311-10.0KHRCT-ND; Operating Temperature: -55°C ~ 155°C
U10 = SQUIB_MC33797: Manufacturer: NXP USA Inc.; Interface: SPI; Voltage - Supply: 4.75 V ~ 5.25 V; Supplier 1: Digi-Key; RoHS: RoHS Compliant; Category: Integrated Circuits (ICs); Stock 1: 657; Pricing 1: 1=4.94, 10=4.437, 100=3.6354, 500=3.2136 (USD); Packaging: Cut Tape (CT); Part Status: Active; Applications: -; Package / Case: 32-SOIC (0.295", 7.50mm Width); Supplier Device Package: 32-SOIC; Mounting Type: Surface Mount; ComponentLink1URL: http://cache.freescale.com/files/analog/doc/data_sheet/MC33797.pdf; ComponentLink1Description: http://cache.freescale.com/files/analog/doc/data_sheet/MC33797.pdf; Supplier Part Number 1: MC33797BPEWR2CT-ND

## Sheet SD.SchDoc
size A4
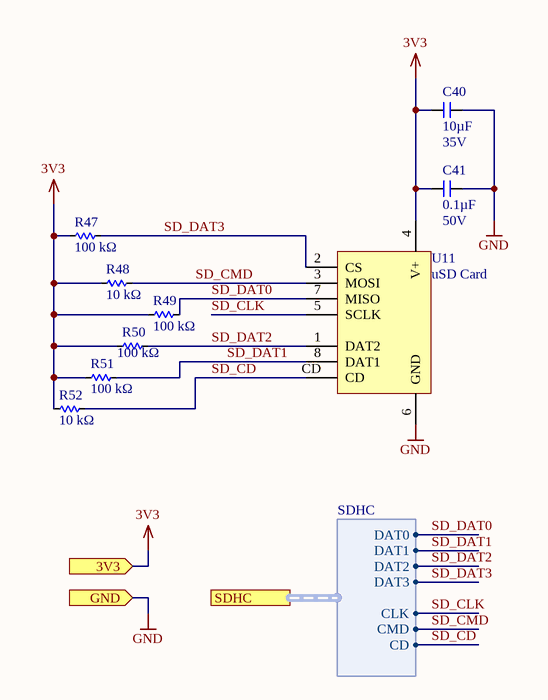
[diagram p9: SD.SchDoc]

### Parts
C40  Capacitance (shorthand): 10µF  Rated Voltage: 35V  [C0603]  (hidden comment: __template_cap)
C41  Capacitance (shorthand): 0.1µF  Rated Voltage: 50V  [C0603]  (hidden comment: __template_cap)
R47  Resistance: 100 kΩ  [R0603]  (hidden comment: __template_resistor)
R48  Resistance: 10 kΩ  [R0603]  (hidden comment: __template_resistor)
R49  Resistance: 100 kΩ  [R0603]  (hidden comment: __template_resistor)
R50  Resistance: 100 kΩ  [R0603]  (hidden comment: __template_resistor)
R51  Resistance: 100 kΩ  [R0603]  (hidden comment: __template_resistor)
R52  Resistance: 10 kΩ  [R0603]  (hidden comment: __template_resistor)
U11  uSD Card  [MICROSD_CARD_SOCKET]

### Ports
3V3 (in), GND (in), SDHC (harness SDHC)

### Harnesses
SDHC: DAT3, DAT0, DAT2, DAT1, CLK, CMD, CD

### Nets
3V3: C40.2 C41.1 R47.1 R48.1 R49.1 R50.1 R51.1 R52.1 U11.4(V+) ; port 3V3
GND: C40.1 C41.2 U11.6(GND) ; port GND  [project net SELF_GND]
SD_CD: R52.2 U11.CD ; port SDHC.CD
SD_CLK: U11.5(SCLK) ; port SDHC.CLK
SD_CMD: R48.2 U11.3(MOSI) ; port SDHC.CMD
SD_DAT0: R49.2 U11.7(MISO) ; port SDHC.DAT0
SD_DAT1: R51.2 U11.8(DAT1) ; port SDHC.DAT1
SD_DAT2: R50.2 U11.1(DAT2) ; port SDHC.DAT2
SD_DAT3: R47.2 U11.2(CS) ; port SDHC.DAT3

### Notes on the sheet
- Title
- Size:
- Date:
- A4
- Number:
- Time:
- Revision:
- Sheet
- of
- File:

### Library data of the parts
C40 = CAP CER 10UF 35V X5R 0603 20%: as C46 on sheet SAMD51; Supplier 1: Digikey; Supplier Part Number 1: 490-13248-1-ND
C41 = CAP CER 0603 0.1µF X7R 50V 10%: as C43 on sheet SAMD51; Supplier 1: Digikey; Supplier Part Number 1: 490-1519-1-ND
R47 R49-R51 = RES SMD 100K OHM 1% 1/10W 0603: Manufacturer Part Number: RC0603FR-07100KL; Manufacturer: Yageo; Resistance (Sortable): 100000; Tolerance: ±1%; Power (Watts): 0.1W, 1/10W; Temperature Coefficient: ±100ppm/°C; Supplier 1: Digikey; Datasheets: http://www.yageo.com/documents/recent/PYu-RC_Group_51_RoHS_L_9.pdf; Image: //media.digikey.com/Renders/Yageo%20Renders/0603-(1608-Metric).jpg; Supplier Part Number 1: 311-100KHRCT-ND; Operating Temperature: -55°C ~ 155°C
R48 R52 = RES SMD 10K OHM 1% 1/10W 0603: as R59 on sheet SAMD51; Supplier 1: Digikey; Datasheets: http://www.yageo.com/documents/recent/PYu-RC_Group_51_RoHS_L_9.pdf; Image: //media.digikey.com/Renders/Yageo%20Renders/0603-(1608-Metric).jpg; Supplier Part Number 1: 311-10.0KHRCT-ND; Operating Temperature: -55°C ~ 155°C
U11 = MICRO_SD_CARD_HOLDER: MICROSD CARD HOLDER, PUSH-PUSH; pin to pad: 6>6+SHIELD1+SHIELD2+SHIELD3; Manufacturer: 3M; Manufacturer Part Number: 2908-05WB-MG; Card Type: Secure Digital - microSD™; Number of Positions: 10 (8 + 2); Connector Type: Connector and Ejector; Insertion, Removal Method: Push In, Push Out; Supplier 1: Digi-Key; RoHS: RoHS Compliant; Category: Connectors, Interconnects; Stock 1: 32313; Pricing 1: 1=3.6, 10=3.458, 25=3.1704, 50=3.0262, 100=2.882, 250=2.52176, 500=2.4497, 1000=2.08945 (USD); Packaging: Cut Tape (CT); Ejector Side: -; Mounting Type: Surface Mount, Right Angle; Features: Switch; Height Above Board: 0.073" (1.85mm); Mounting Feature: Normal, Standard - Top; Contact Finish: Gold; Contact Finish Thickness: 15µin (0.38µm); ComponentLink1URL: http://multimedia.3m.com/mws/media/416257O/3mtm-card-connector-microsdtm-2900-series-ts2197.pdf; ComponentLink1Description: http://multimedia.3m.com/mws/media/416257O/3mtm-card-connector-microsdtm-2900-series-ts2197.pdf; Supplier Part Number 1: 3M5607CT-ND

## Nets that join several sheets
3V3: Sensor1 (6 pins), Battery_Management (8 pins), Blink_Blink_Beep_Boop (D7.2 U4.1), ESP8266 (C19.1 R17.2 R20.2 U5.1), SAMD51 (13 pins), Sensor2 (6 pins), Stack_A (8 pins), SD (9 pins)
5V0: Sensor1 (C9-1.1 U2-1.1 U2-1.3), Battery_Management (8 pins), Sensor2 (C9-2.1 U2-2.1 U2-2.3), Stack_A (10 pins), MC33797 (C38.1 R38.2 U10.10)
SELF_GND: Salmon (BAT2.- D9.1 D10.1), Sensor1 (21 pins), Battery_Management (32 pins), Blink_Blink_Beep_Boop (5 pins), ESP8266 (11 pins), SAMD51 (23 pins), Sensor2 (21 pins), Stack_A (14 pins), MC33797 (10 pins), SD (C40.1 C41.2 U11.6)
VBACKUP: Salmon (BAT2.+), SAMD51 (U12.64)
VBAT: Battery_Management (13 pins), MC33797 (9 pins)
ACCEL_CS_1: Sensor1 (U8-1.14), SAMD51 (U12.12)
ACCEL_CS_2: SAMD51 (U12.6), Sensor2 (U8-2.14)
ACCEL_INT_1: Sensor1 (U8-1.16), SAMD51 (U12.50)
ACCEL_INT_2: SAMD51 (U12.39), Sensor2 (U8-2.16)
ADXL_CS_1: Sensor1 (U6-1.7), SAMD51 (U12.9)
ADXL_CS_2: SAMD51 (U12.3), Sensor2 (U6-2.7)
ADXL_INT_1: Sensor1 (U6-1.8), SAMD51 (U12.49)
ADXL_INT_2: SAMD51 (U12.31), Sensor2 (U6-2.8)
ARM1: Salmon (R24.2 R26.1 R27.2), MC33797 (U10.13)
ARM2: Salmon (R25.2 R28.2 R29.1), MC33797 (U10.20)
BAT_SNS_A: Battery_Management (D2.2 R11.1 R12.2), SAMD51 (U12.63)
BAT_SNS_B: Battery_Management (D1.2 R5.1 R6.2), SAMD51 (U12.62)
BMP_CS_1: Sensor1 (U7-1.6), SAMD51 (U12.10)
BMP_CS_2: SAMD51 (U12.4), Sensor2 (U7-2.6)
BUZZER: Blink_Blink_Beep_Boop (Q2.1), SAMD51 (U12.61)
CAN_STBY_1: SAMD51 (U12.41), Stack_A (CANA1.8)
CAN_STBY_2: SAMD51 (U12.42), Stack_A (CANB1.8)
GYRO_CS_1: Sensor1 (U8-1.5), SAMD51 (U12.11)
GYRO_CS_2: SAMD51 (U12.5), Sensor2 (U8-2.5)
GYRO_INT_1: Sensor1 (U8-1.12), SAMD51 (U12.51)
GYRO_INT_2: SAMD51 (U12.40), Sensor2 (U8-2.12)
LED_1: Blink_Blink_Beep_Boop (R13.1), SAMD51 (P1.4 R58.1 U12.57)
LED_2: Blink_Blink_Beep_Boop (R14.1), SAMD51 (P1.2 U12.58)
LED_3: Blink_Blink_Beep_Boop (R15.1), SAMD51 (U12.59)
LED_4: Blink_Blink_Beep_Boop (R16.1), SAMD51 (U12.60)
MISO: Sensor1 (U6-1.12 U7-1.5 U8-1.10 U8-1.15), SAMD51 (U12.13), Sensor2 (U6-2.12 U7-2.5 U8-2.10 U8-2.15)
MOSI: Sensor1 (U6-1.13 U7-1.4 U8-1.9), SAMD51 (U12.16), Sensor2 (U6-2.13 U7-2.4 U8-2.9)
NetCANA1_1: SAMD51 (U12.26), Stack_A (CANA1.1 I2.3)
NetCANA1_4: SAMD51 (U12.25), Stack_A (CANA1.4 I2.2)
NetCANB1_1: SAMD51 (U12.44), Stack_A (CANB1.1 I1.2)
NetCANB1_4: SAMD51 (U12.43), Stack_A (CANB1.4 I1.3)
NetJ1_1: ESP8266 (J1.1 U5.12), SAMD51 (U12.30)
NetJ1_2: ESP8266 (J1.2 U5.11), SAMD51 (U12.29)
NetR19_1: Salmon (R26.2), ESP8266 (R19.1 U5.3)
NetR22_1: Salmon (R29.2), ESP8266 (R22.1 U5.10)
SCK: Sensor1 (U6-1.14 U7-1.2 U8-1.8), SAMD51 (U12.14), Sensor2 (U6-2.14 U7-2.2 U8-2.8)
SD_CD: SAMD51 (U12.15), SD (R52.2 U11.CD)
SD_CLK: SAMD51 (U12.24), SD (U11.5)
SD_CMD: SAMD51 (U12.17), SD (R48.2 U11.3)
SD_DAT0: SAMD51 (U12.18), SD (R49.2 U11.7)
SD_DAT1: SAMD51 (U12.19), SD (R51.2 U11.8)
SD_DAT2: SAMD51 (U12.20), SD (R50.2 U11.1)
SD_DAT3: SAMD51 (U12.23), SD (R47.2 U11.2)
SELF_A+: Stack_B (B_BOTTOM1.2 B_TOP1.1), MC33797 (U10.5)
SELF_A-: Stack_B (B_BOTTOM1.4 B_TOP1.3), MC33797 (U10.1 U10.2)
SELF_ARM1: Salmon (R24.1), Stack_A (A_BOTTOM1.10 A_TOP1.9)
SELF_ARM2: Salmon (R25.1), Stack_A (A_BOTTOM1.12 A_TOP1.11)
SELF_B+: Stack_B (B_BOTTOM1.6 B_TOP1.5), MC33797 (U10.12)
SELF_B-: Stack_B (B_BOTTOM1.8 B_TOP1.7), MC33797 (U10.15 U10.16)
SELF_C+: Stack_B (B_BOTTOM1.10 B_TOP1.9), MC33797 (U10.28)
SELF_C-: Stack_B (B_BOTTOM1.12 B_TOP1.11), MC33797 (U10.31 U10.32)